# Altium project DM1092_LiPo_R0M0E0.PrjPcb (part 6 of 6)
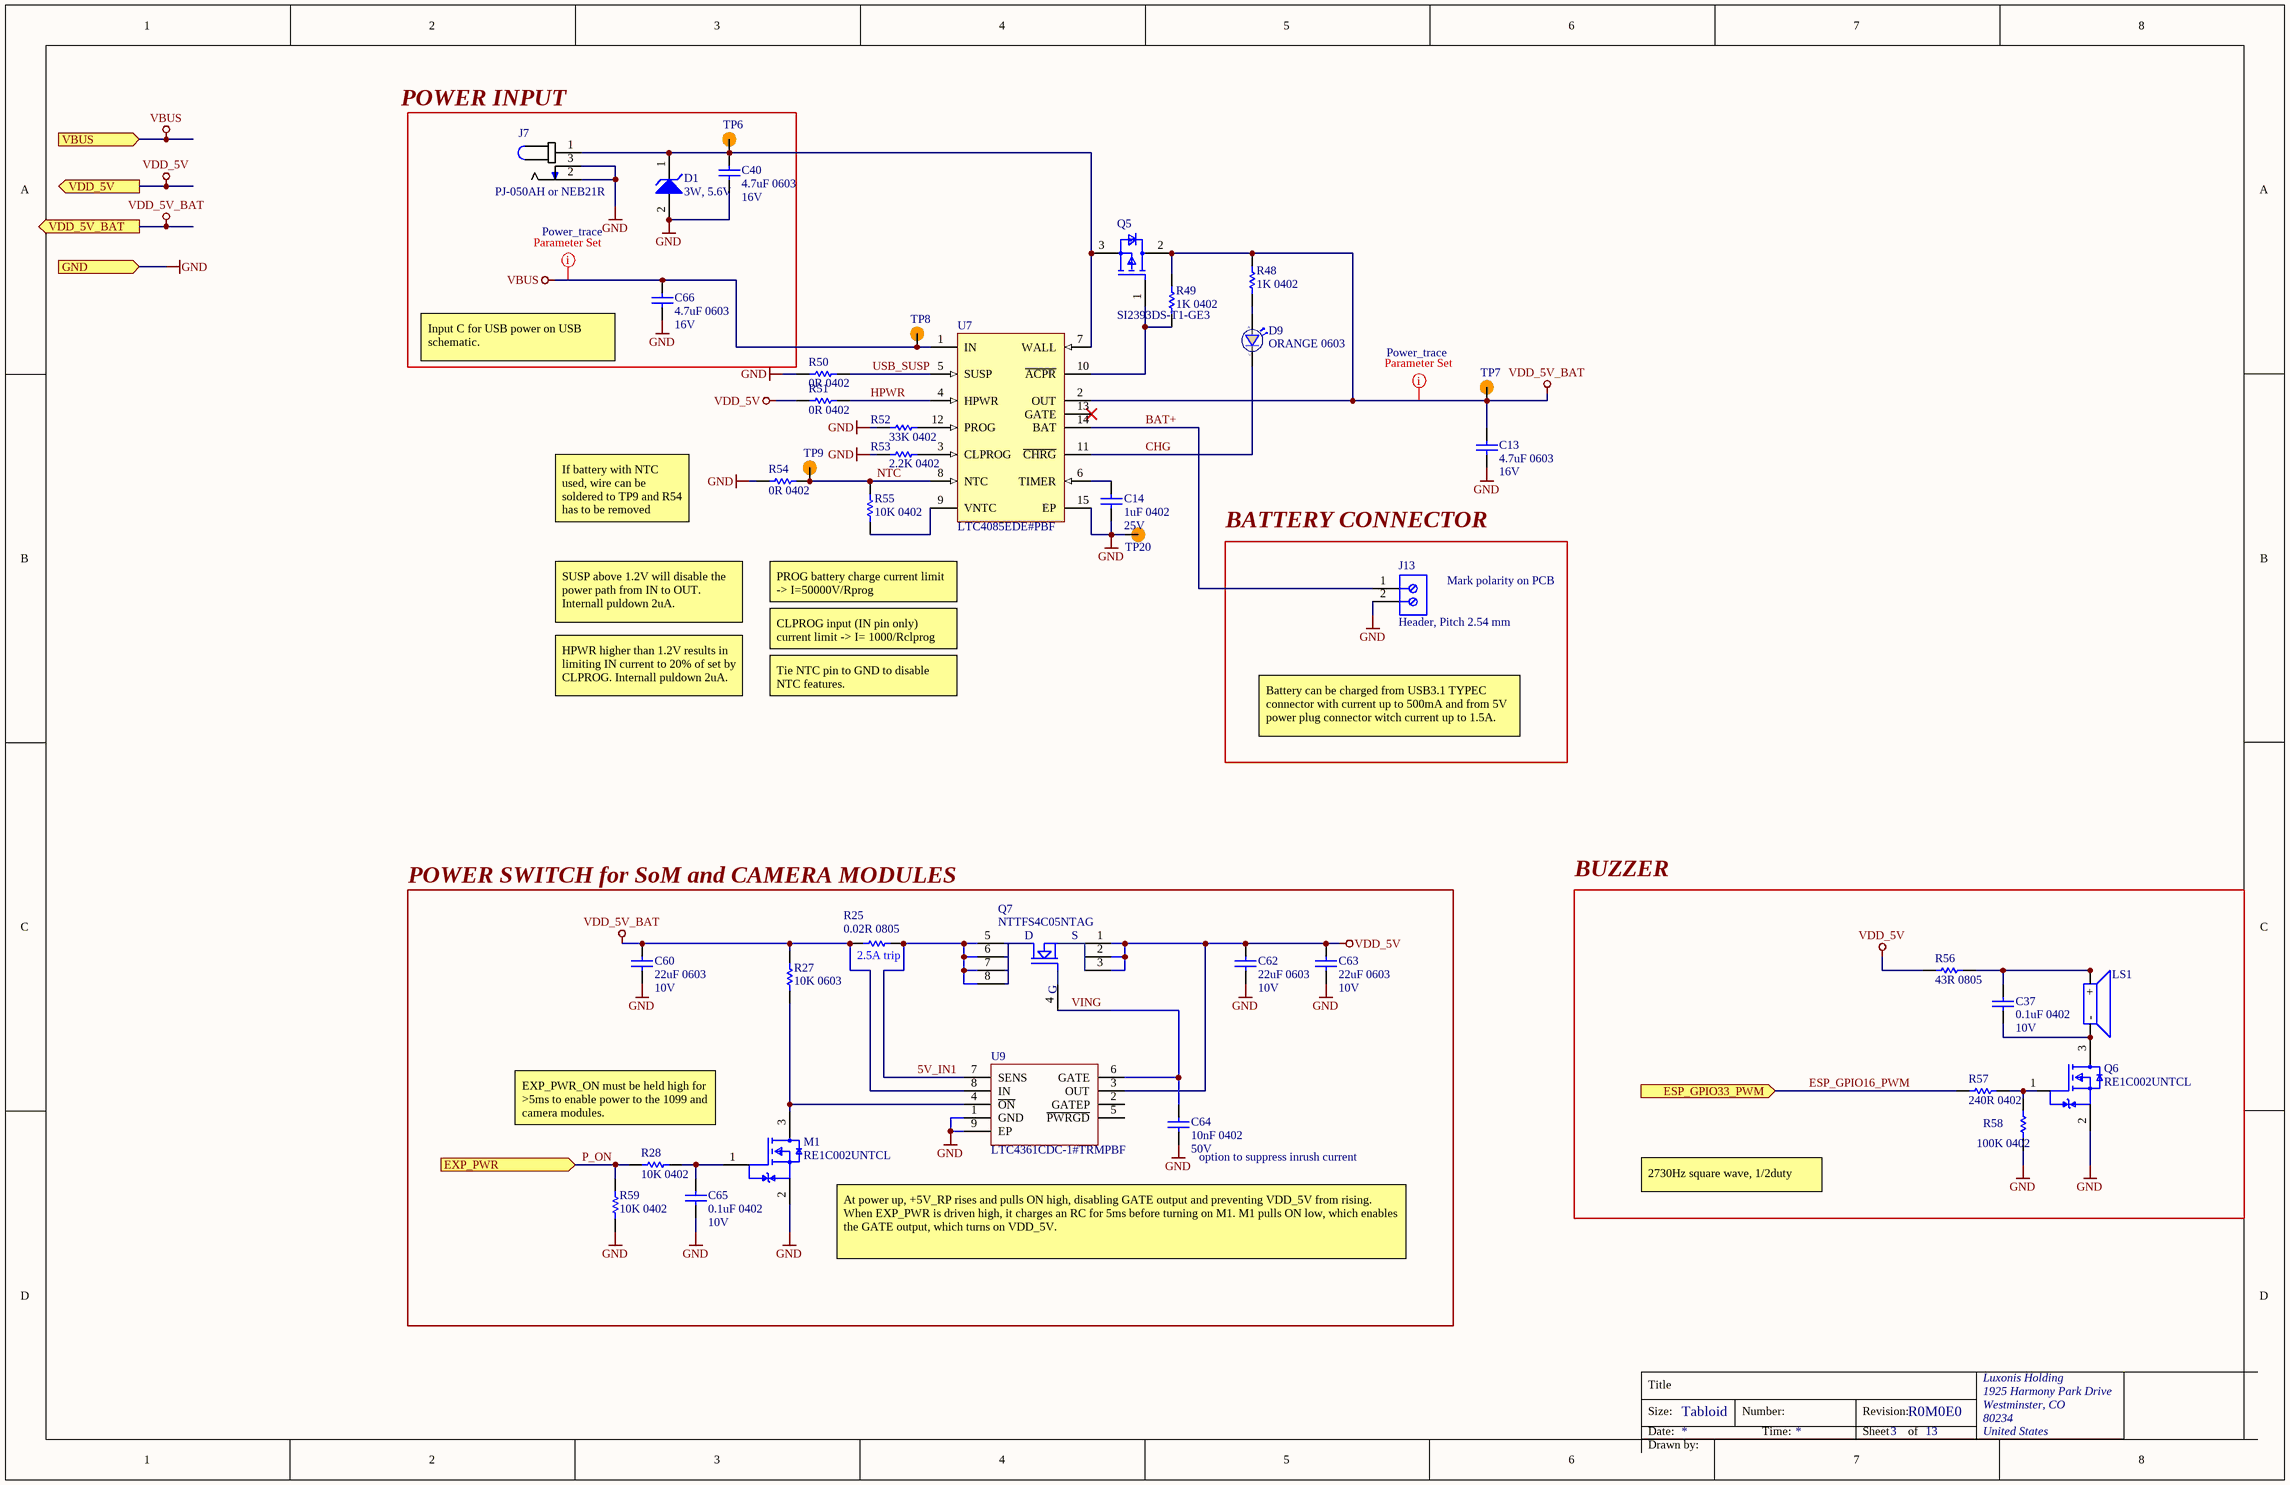
[diagram p12: DM1092_Battery&Alarm.SchDoc]

## Sheet DM1092_Battery&Alarm.SchDoc: =project_title (continued)

### Library data of the parts (continued)
R58 = RC0402FR-07100KL: RES SMD 100K OHM 1% 1/16W 0402; Manufacturer 1: Yageo; Resistance: 100kR; Temperature Coefficient: 100ppm/°C; Power Rating: 63mW; Voltage Rating: 50V; Supplier 1: Digi-Key; Supplier Part Number 1: 311-100KLRCT-ND; RoHS: Yes; Stock 1: 50867324; Pricing 1: 1=0.10000, 10=0.01500, 100=0.00600, 1000=0.00270, 2500=0.00235, 5000=0.00194 (USD); Case/Package: 0402; Case Code (Metric): 1005; Case Code (Imperial): 0402; Min Operating Temperature: -55°C; Max Operating Temperature: 155°C; Tolerance: 1%; Packaging: Tape and Reel; Termination: SMD/SMT; Length: 0.039inch; Width: 0.02inch; Height: 0.016inch; Depth: 0.5mm; REACH SVHC: No SVHC; Military Standard: Not; Lead Free: Lead Free; ComponentLink1URL: https://datasheet.ciiva.com/11819/0900766b80c66297-11819452.pdf?src-supplier=RSComponents; ComponentLink1Description: https://datasheet.ciiva.com/11819/0900766b80c66297-11819452.pdf?src-supplier=RSComponents; ComponentLink2URL: https://datasheet.ciiva.com/2453/pyu-r-int-thick-7-2453361.pdf?src-supplier=Digi-Key; ComponentLink2Description: https://datasheet.ciiva.com/2453/pyu-r-int-thick-7-2453361.pdf?src-supplier=Digi-Key; ComponentLink3URL: https://datasheet.ciiva.com/2453/pyu-r-int-thick-7-2453362.pdf?src-supplier=Digi-Key; ComponentLink3Description: https://datasheet.ciiva.com/2453/pyu-r-int-thick-7-2453362.pdf?src-supplier=Digi-Key; ComponentLink4URL: https://datasheet.ciiva.com/2453/pyu-r-int-thick-7-2453363.pdf?src-supplier=Digi-Key; ComponentLink4Description: https://datasheet.ciiva.com/2453/pyu-r-int-thick-7-2453363.pdf?src-supplier=Digi-Key; ComponentLink5URL: https://datasheet.ciiva.com/22747/1018594-22747509.pdf?src-supplier=Element14; ComponentLink5Description: https://datasheet.ciiva.com/22747/1018594-22747509.pdf?src-supplier=Element14; ComponentLink6URL: https://datasheet.ciiva.com/15189/getdatasheetpartid-323696-15189334.pdf?src-supplier=Verical; ComponentLink6Description: https://datasheet.ciiva.com/15189/getdatasheetpartid-323696-15189334.pdf?src-supplier=Verical; ComponentLink7URL: https://datasheet.ciiva.com/12667/pyu-rc0402-51-rohs-l-6-r-12667930.pdf?src-supplier=Mouser; ComponentLink7Description: https://datasheet.ciiva.com/12667/pyu-rc0402-51-rohs-l-6-r-12667930.pdf?src-supplier=Mouser; Manufacturer Part Number 1: RC0402FR-07100KL; Composition: Thick Film; Supplier 2: Newark; Supplier 3: Mouser; Supplier Part Number 2: 67R9887; Supplier Part Number 3: 603-RC0402FR-07100KL; Package Quantity: 1; Number of Terminations: 2; Max Power Dissipation: 63mW; Features: Moisture Resistant; Working Voltage: 50V
TP6-TP9 TP20 = TEST_POINT
U7 = LTC4085EDE#PBF: USB Power Manager with Ideal Diode Controller and Li-Ion Charger with 4.2 V Float Voltage, 29% Vvntc, Undervoltage Current Limit, 4.35 to 5.5 V Vin, 14-pin SON (DE-14), -40 to 85 degC, Pb-Free; Manufacturer: Linear Technology; Manufacturer 1: Analog Devices / Linear Technology; Vin Min(V): 4.35; Number of Cells: 1; Vin Max(V): 5.5; PartNumber: LTC4085EDE#PBF; DatasheetVersion: Rev. D; Code_JEDEC: MO-229; PackageVersion: Rev. B, 06/2010; ComponentLink2Description: Datasheet; ComponentLink2URL: http://cds.linear.com/docs/en/datasheet/4085fd.pdf; Number of Outputs: 1; PackageReference: DE-14; ComponentLink3URL: http://www.linear.com/docs/en/packaging/DFN_14_05-08-1708.pdf; RoHS: TRUE; ComponentLink3Description: Package Specification; Mounting Technology: Surface Mount; PackageDescription: 14-Pin Plastic DFN, Body 4 x 3 mm, Pitch 0.5 mm; ComponentLink1URL: http://www.linear.com/; ComponentLink1Description: Manufacturer URL; Manufacturer Part Number 1: LTC4085EDE#PBF; Supplier 1: Digi-Key; Supplier Part Number 1: LTC4085EDE#PBF-ND
U9 = LTC4361CDC-1#TRMPBF: IC OVERVOLTAGE/CUR PROT 8-DFN Handheld/Mobile Devices PMIC 8-DFN (2x2); Manufacturer 1: Analog Devices / Linear Technology; Min Supply Voltage: 2.5V; Max Supply Voltage: 5.5V; Supplier 1: Digi-Key; Manufacturer Part Number 1: LTC4361CDC-1#TRMPBF; Stock 1: 4205; Pricing 1: 1=3.62000, 25=2.40680, 100=1.99000, 250=1.89048 (USD); RoHS: Yes; Case/Package: DFN; Number of Pins: 8; Min Operating Temperature: 0°C; Max Operating Temperature: 70°C; Package Quantity: 1; Packaging: Tape and Reel; Length: 2mm; REACH SVHC: No SVHC; ComponentLink1URL: https://datasheet.ciiva.com/1569/1441932-1569140.pdf?src-supplier=Farnell; ComponentLink1Description: https://datasheet.ciiva.com/1569/1441932-1569140.pdf?src-supplier=Farnell; ComponentLink2URL: https://datasheet.ciiva.com/1569/1441932-1569141.pdf?src-supplier=Farnell; ComponentLink2Description: https://datasheet.ciiva.com/1569/1441932-1569141.pdf?src-supplier=Farnell; ComponentLink3URL: https://datasheet.ciiva.com/1941/29266-1941719.pdf?src-supplier=Digi-Key; ComponentLink3Description: https://datasheet.ciiva.com/1941/29266-1941719.pdf?src-supplier=Digi-Key; ComponentLink4URL: https://datasheet.ciiva.com/1511/1692593-1511384.pdf?src-supplier=Element14; ComponentLink4Description: https://datasheet.ciiva.com/1511/1692593-1511384.pdf?src-supplier=Element14; ComponentLink5URL: https://datasheet.ciiva.com/1941/29266-1941720.pdf?src-supplier=Digi-Key; ComponentLink5Description: https://datasheet.ciiva.com/1941/29266-1941720.pdf?src-supplier=Digi-Key; ComponentLink6URL: https://datasheet.ciiva.com/1941/29266-1941721.pdf?src-supplier=Digi-Key; ComponentLink6Description: https://datasheet.ciiva.com/1941/29266-1941721.pdf?src-supplier=Digi-Key; Supplier Part Number 1: LTC4361CDC-1#TRMPBFCT-ND

## Sheet DM1092_uSD.SchDoc: =project_title
size Tabloid; CompanyName: Luxonis Holding; DrawnBy: David Malovrh; Organization: Luxonis Holding; Address1: 1925 Harmony Park Drive; Address2: Westminster, CO; Address3: 80234; Address4: United States; DocumentNumber: DXXXX; Revision: R0M0E0
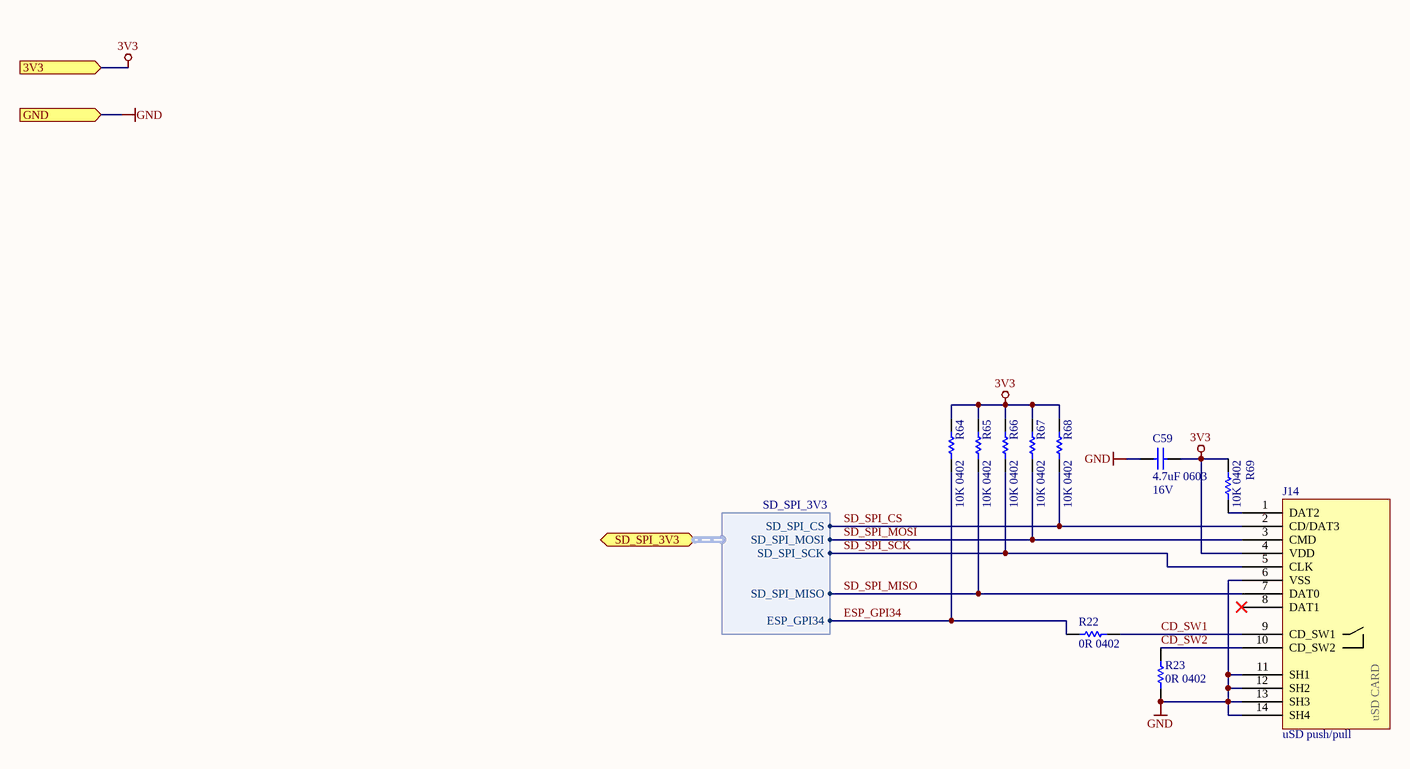
[diagram p10: DM1092_uSD.SchDoc]

### Parts
C59  4.7uF 0603  Voltage Rating: 16V  [CAPC0603(1608)100_N]
J14  uSD push/pull  [104031-0811]
R22  0R 0402  [RESC0402(1005)_N]
R23  0R 0402  [RESC0402(1005)_N]
R64  10K 0402  [RESC0402(1005)_N]
R65  10K 0402  [RESC0402(1005)_N]
R66  10K 0402  [RESC0402(1005)_N]
R67  10K 0402  [RESC0402(1005)_N]
R68  10K 0402  [RESC0402(1005)_N]
R69  10K 0402  [RESC0402(1005)_N]

### Ports
3V3 (in), GND (in), SD_SPI_3V3 (bidir, harness SD_SPI_3V3)

### Harnesses
SD_SPI_3V3: SD_SPI_MISO, SD_SPI_MOSI, SD_SPI_SCK, SD_SPI_CS, ESP_GPI34

### Nets
3V3: C59.2 J14.4(VDD) R64.2 R65.2 R66.2 R67.2 R68.2 R69.2 ; port 3V3
GND: C59.1 J14.6(VSS) J14.11(SH1) J14.12(SH2) J14.13(SH3) J14.14(SH4) R23.1 ; port GND
CD_SW1: J14.9(CD_SW1) R22.1
CD_SW2: J14.10(CD_SW2) R23.2
ESP_GPI34: R22.2 R64.1 ; port SD_SPI_3V3.ESP_GPI34
SD_SPI_CS: J14.2(CD/DAT3) R68.1 ; port SD_SPI_3V3.SD_SPI_CS
SD_SPI_MISO: J14.7(DAT0) R65.1 ; port SD_SPI_3V3.SD_SPI_MISO
SD_SPI_MOSI: J14.3(CMD) R67.1 ; port SD_SPI_3V3.SD_SPI_MOSI
SD_SPI_SCK: J14.5(CLK) R66.1 ; port SD_SPI_3V3.SD_SPI_SCK
NetJ14_1: J14.1(DAT2) R69.1

Not connected (* = marked no-connect by the designer): J14 8(DAT1)*

### Notes on the sheet
- Title
- Size:
- Date:
- Tabloid
- Number:
- Time:
- Revision:
- Sheet
- of
- Drawn by:
- (in symbol 104031-0811) uSD CARD

### Library data of the parts
C59 = GRM188R61C475KAAJD: CAP CER 4.7UF 16V X5R 0603 10%; Manufacturer 1: Murata; Material: Ceramic; Manufacturer Part Number 1: GRM188R61C475KAAJD; Supplier 1: Digi-Key; Stock 1: 455058; Pricing 1: 1=0.35000, 10=0.24600, 100=0.14730, 500=0.11050, 1000=0.09331 (USD); RoHS: Yes; Mount: Surface Mount; Case/Package: 0603; Weight: 0.000222oz; Case Code (Metric): 1608; Case Code (Imperial): 0603; Min Operating Temperature: -55°C; Max Operating Temperature: 85°C; Capacitance: 4.7uF; Tolerance: 10%; Packaging: Tape and Reel; Dielectric: X5R; Termination: SMD/SMT; Voltage Rating (DC): 16V; Package Quantity: 4000; Length: 1.6mm; Height: 0.8mm; Width: 0.8mm; Thickness: 0.037inch; Depth: 0.8mm; REACH SVHC: No SVHC; Lead Free: Lead Free; ComponentLink1URL: https://datasheet.ciiva.com/14813/595grm188r61c475kaaj23-14813668.pdf?src-supplier=Arrow; ComponentLink1Description: https://datasheet.ciiva.com/14813/595grm188r61c475kaaj23-14813668.pdf?src-supplier=Arrow; Supplier 2: Digi-Key; Manufacturer 2: Murata; Manufacturer Part Number 2: GRM188R61C475KAAJD; Stock 2: 455058; Pricing 2: 1=0.35000, 10=0.24600, 100=0.14730, 500=0.11050, 1000=0.09331 (USD); Supplier 3: Digi-Key; Manufacturer 3: Murata; Manufacturer Part Number 3: GRM188R61C475KAAJD; Stock 3: 452000; Pricing 3: 4000=0.07259, 8000=0.06832, 12000=0.06619, 28000=0.06405 (USD); Supplier Part Number 1: 490-10481-1-ND; Supplier Part Number 2: 490-10481-6-ND; Supplier Part Number 3: 490-10481-2-ND
J14 = 104031-0811: CONN MICRO SD CARD PUSH-PULL R/A; Manufacturer 1: Molex; Manufacturer Part Number 1: 104031-0811; Supplier 1: Digi-Key; Stock 1: 19400; Pricing 1: 1=2.02000, 10=1.82900, 25=1.71680, 50=1.64220, 100=1.56760, 250=1.41828, 500=1.30630, 1000=1.11969 (USD); RoHS: No; Supplier 2: Newark; Supplier 3: Mouser; Supplier Part Number 1: WM6357CT-ND; Supplier Part Number 2: 99R5410; Supplier Part Number 3: 538-104031-0811
R22 R23 = CRCW04020000Z0ED: RES SMD 0 OHM JUMPER 1/16W 0402; Manufacturer 1: Vishay; Resistance: 0mR; Power Rating: 63mW; Voltage Rating: 50V; Temperature Coefficient: 100ppm/°C; Tolerance: 5%; Manufacturer Part Number 1: CRCW04020000Z0ED; Supplier 1: Digi-Key; Stock 1: 855968; Pricing 1: 1=0.10000, 10=0.03400, 25=0.02440, 50=0.01860, 100=0.01380, 250=0.01048, 500=0.00840, 1000=0.00618, 5000=0.00443 (USD); RoHS: Yes; Mount: Surface Mount; Case/Package: 0402; Weight: 2.3E-05oz; Case Code (Imperial): 0402; Case Code (Metric): 1005; Contact Plating: Tin; Min Operating Temperature: -55°C; Max Operating Temperature: 155°C; Packaging: Tape and Reel; Composition: Thick Film; Voltage Rating (DC): 50V; Package Quantity: 1; Termination: SMD/SMT; Number of Terminations: 2; Military Standard: Not; Max Power Dissipation: 63mW; Features: Automotive AEC-Q200; Length: 1mm; Height: 0.35mm; Width: 0.5mm; Depth: 0.5mm; Radiation Hardening: No; REACH SVHC: Unknown; Lead Free: Lead Free; ComponentLink1URL: https://datasheet.ciiva.com/3255/dcrcwe3-3255944.pdf?src-supplier=Avnet; ComponentLink1Description: https://datasheet.ciiva.com/3255/dcrcwe3-3255944.pdf?src-supplier=Avnet; ComponentLink2URL: https://datasheet.ciiva.com/3255/dcrcwe3-3255945.pdf?src-supplier=Avnet; ComponentLink2Description: https://datasheet.ciiva.com/3255/dcrcwe3-3255945.pdf?src-supplier=Avnet; ComponentLink3URL: https://datasheet.ciiva.com/16881/dcrcwe3-16881413.pdf?src-supplier=Avnet+Europe; ComponentLink3Description: https://datasheet.ciiva.com/16881/dcrcwe3-16881413.pdf?src-supplier=Avnet+Europe; ComponentLink4URL: https://datasheet.ciiva.com/2461/dcrcwe3-2461962.pdf?src-supplier=Digi-Key; ComponentLink4Description: https://datasheet.ciiva.com/2461/dcrcwe3-2461962.pdf?src-supplier=Digi-Key; ComponentLink5URL: https://datasheet.ciiva.com/7841/1720486-7841802.pdf?src-supplier=Element14; ComponentLink5Description: https://datasheet.ciiva.com/7841/1720486-7841802.pdf?src-supplier=Element14; ComponentLink6URL: https://datasheet.ciiva.com/2461/dcrcwe3-2461963.pdf?src-supplier=Digi-Key; ComponentLink6Description: https://datasheet.ciiva.com/2461/dcrcwe3-2461963.pdf?src-supplier=Digi-Key; ComponentLink7URL: https://datasheet.ciiva.com/2461/dcrcwe3-2461964.pdf?src-supplier=Digi-Key; ComponentLink7Description: https://datasheet.ciiva.com/2461/dcrcwe3-2461964.pdf?src-supplier=Digi-Key; ComponentLink8URL: https://datasheet.ciiva.com/7841/1697337-7841468.pdf?src-supplier=Element14; ComponentLink8Description: https://datasheet.ciiva.com/7841/1697337-7841468.pdf?src-supplier=Element14; ComponentLink9URL: https://datasheet.ciiva.com/16761/70200976-16761309.pdf?src-supplier=Allied+Electronics; ComponentLink9Description: https://datasheet.ciiva.com/16761/70200976-16761309.pdf?src-supplier=Allied+Electronics; ComponentLink10URL: https://datasheet.ciiva.com/26311/fld-crcw-e3-data-en-26311550.pdf?src-supplier=Distrelec; ComponentLink10Description: https://datasheet.ciiva.com/26311/fld-crcw-e3-data-en-26311550.pdf?src-supplier=Distrelec; Supplier Part Number 1: 541-0.0JCT-ND
R64-R69 = RC0402FR-1310KL: RES SMD 10K OHM 1% 0402 1/16W Chip Resistor, 0402 [1005 Metric], 10 kohm, RC Series, 50 V, Thick Film, 62.5 mW; Manufacturer 1: Yageo; Resistance: 10kR; Temperature Coefficient: 100ppm/°C; Power Rating: 62.5mW; Voltage Rating: 50V; ComponentLink1URL: https://datasheet.ciiva.com/16940/pyu-rc0402-51-rohs-l-6-16940293.pdf?src-supplier=Avnet+Europe; ComponentLink1Description: https://datasheet.ciiva.com/16940/pyu-rc0402-51-rohs-l-6-16940293.pdf?src-supplier=Avnet+Europe; ComponentLink2URL: https://datasheet.ciiva.com/28386/pyu-rc0402-51-rohs-l-6-28386855.pdf?src-supplier=Avnet+Europe; ComponentLink2Description: https://datasheet.ciiva.com/28386/pyu-rc0402-51-rohs-l-6-28386855.pdf?src-supplier=Avnet+Europe; ComponentLink3URL: https://datasheet.ciiva.com/16740/pyu-rc0402-51-rohs-l-6-r-16740602.pdf?src-supplier=Future+Electronics; ComponentLink3Description: https://datasheet.ciiva.com/16740/pyu-rc0402-51-rohs-l-6-r-16740602.pdf?src-supplier=Future+Electronics; ComponentLink4URL: https://datasheet.ciiva.com/8891/pyu-rc0402-51-rohs-l-6-8891339.pdf?src-supplier=Avnet; ComponentLink4Description: https://datasheet.ciiva.com/8891/pyu-rc0402-51-rohs-l-6-8891339.pdf?src-supplier=Avnet; ComponentLink5URL: https://datasheet.ciiva.com/5557/pyu-rc0402-51-rohs-l-6-r-5557997.pdf?src-supplier=Mouser; ComponentLink5Description: https://datasheet.ciiva.com/5557/pyu-rc0402-51-rohs-l-6-r-5557997.pdf?src-supplier=Mouser; ComponentLink6URL: https://datasheet.ciiva.com/7983/1018594-7983533.pdf?src-supplier=Element14; ComponentLink6Description: https://datasheet.ciiva.com/7983/1018594-7983533.pdf?src-supplier=Element14; Supplier 1: Newark; Manufacturer Part Number 1: RC0402FR-1310KL; Stock 1: 62239; Pricing 1: 1=0.10000, 25=0.01200, 100=0.00400, 250=0.00400, 500=0.00300, 1000=0.00300 (USD); RoHS: Yes; Case/Package: 0402; Number of Pins: 2; Contact Plating: Tin,Matte,Lead; Case Code (Imperial): 0402; Case Code (Metric): 1005; Min Operating Temperature: -55°C; Max Operating Temperature: 155°C; Tolerance: 1%; Composition: Thick Film; Packaging: Tape and Reel; Termination: SMD/SMT; Military Standard: Not; Voltage Rating (DC): 50V; Working Voltage: 50V; Number of Terminations: 2; Length: 1mm; Depth: 0.5mm; Radiation Hardening: No; REACH SVHC: No SVHC; Lead Free: Lead Free; Supplier Part Number 1: 67R9960; Supplier 2: Future Electronics; Supplier 3: Mouser; Supplier 4: Element14; Supplier Part Number 2: RC0402FR-1310KL-CUTT; Supplier Part Number 3: 603-RC0402FR-1310KL; Supplier Part Number 4: 1799235

## Nets that join several sheets
1V2: DM1092_Power_Supply (C39.2 TP10.1 U8.5), DM1092_LEFT_OV9282 (FB6.1)
1V8: DM1092_Power_Supply (C18.2 TP11.1 U2.5), DM1092_LEFT_OV9282 (FB5.1), DM1092_IMU (10 pins), DM1092_LEVEL_SHIFT (6 pins)
2V8: DM1092_Power_Supply (C20.2 TP12.1 U3.5), DM1092_LEFT_OV9282 (FB4.1)
3V3: DM1092_Power_Supply (C16.1 L2.2 R5.2), DM1092_USB (C35.2 R13.2 U5.6), DM1092_ESP32 (9 pins), DM1092_IMU (C42.2 C44.2 U12.3), DM1092_QWIIC (J11.3 J12.3), DM1092_LEVEL_SHIFT (C49.2 C53.2 U13.19 U14.19), DM1092_uSD (8 pins)
GND: DM1092_TopLevel (MP5.1 MP6.1 MP7.1 MP8.1), DM1092_Power_Supply (24 pins), DM1092_LEFT_OV9282 (16 pins), DM1092_USB (28 pins), DM1092_ESP32 (26 pins), DM1092_IMU (10 pins), DM1092_QWIIC (6 pins), DM1092_LEVEL_SHIFT (10 pins), DM1092_Battery&Alarm (25 pins), DM1092_uSD (7 pins)
VBUS: DM1092_USB (10 pins), DM1092_Battery&Alarm (C66.2 TP8.1 U7.1)
VDD_5V: DM1092_Power_Supply (13 pins), DM1092_USB (C36.2 R20.2 R21.2 U6.12), DM1092_Battery&Alarm (8 pins)
VDD_5V_BAT: DM1092_Power_Supply (C15.2 U1.3 U1.5), DM1092_Battery&Alarm (10 pins)
ENV_SCL_1V8: DM1092_IMU (R37.2 U12.15), DM1092_LEVEL_SHIFT (U14.5)
ENV_SCL_3V3: DM1092_QWIIC (J12.1), DM1092_LEVEL_SHIFT (U14.16)
ENV_SDA_1V8: DM1092_IMU (R38.2 U12.16), DM1092_LEVEL_SHIFT (U14.6)
ENV_SDA_3V3: DM1092_QWIIC (J12.2), DM1092_LEVEL_SHIFT (U14.15)
ESP_GPI34: DM1092_ESP32 (J5.4 U11.6), DM1092_uSD (R22.2 R64.1)
ESP_GPIO16_PWM: DM1092_ESP32 (U11.9), DM1092_Battery&Alarm (R57.1)
ESP_GPIO27: DM1092_ESP32 (TP47.1 U11.12), DM1092_LEVEL_SHIFT (U13.13)
EXP_PWR: DM1092_ESP32 (U10.2), DM1092_Battery&Alarm (R28.2 R59.2)
GPIO8/SPI0_CS_1: DM1092_IMU (U12.18), DM1092_LEVEL_SHIFT (U13.8)
I2C3_SCL_3V3: DM1092_ESP32 (R62.1 TP43.1 U10.6 U11.10), DM1092_QWIIC (J11.1), DM1092_LEVEL_SHIFT (U14.14)
I2C3_SDA_3V3: DM1092_ESP32 (R63.1 TP46.1 U10.7 U11.11), DM1092_QWIIC (J11.2), DM1092_LEVEL_SHIFT (U14.13)
MX_INT_3V3: DM1092_ESP32 (TP36.1 U11.8), DM1092_LEVEL_SHIFT (U14.17)
MX_RST_3V3: DM1092_ESP32 (TP45.1 U10.1), DM1092_LEVEL_SHIFT (U14.20)
SD_SPI_CS: DM1092_ESP32 (U11.27), DM1092_uSD (J14.2 R68.1)
SD_SPI_MISO: DM1092_ESP32 (R60.2 TP33.1 U11.36), DM1092_uSD (J14.7 R65.1)
SD_SPI_MOSI: DM1092_ESP32 (R61.2 TP40.1 U11.33), DM1092_uSD (J14.3 R67.1)
SD_SPI_SCK: DM1092_ESP32 (U11.28), DM1092_uSD (J14.5 R66.1)
SPI0_SCK: DM1092_IMU (U12.19), DM1092_LEVEL_SHIFT (U13.6)
SPI0_SIO0: DM1092_IMU (U12.17), DM1092_LEVEL_SHIFT (U13.1)
SPI0_SIO1: DM1092_IMU (U12.20), DM1092_LEVEL_SHIFT (U13.3)
VSPI_CS0: DM1092_ESP32 (TP44.1 U11.29), DM1092_LEVEL_SHIFT (U13.14)
VSPI_HOLDn_SIO3: DM1092_ESP32 (R61.1), DM1092_LEVEL_SHIFT (U13.16)
VSPI_SCK: DM1092_ESP32 (TP42.1 U11.30), DM1092_LEVEL_SHIFT (U13.15)
VSPI_SDI_SIO1: DM1092_ESP32 (TP41.1 U11.31), DM1092_LEVEL_SHIFT (U13.18)
VSPI_SDO_SIO0: DM1092_ESP32 (TP31.1 U11.37), DM1092_LEVEL_SHIFT (U13.20)
VSPI_WPn_SIO2: DM1092_ESP32 (R60.1), DM1092_LEVEL_SHIFT (U13.17)

## Assembly variants
Production: not fitted J5 J6 MISC1 R18 R19 R22 R23 R47 R60 R61 R62 R63 R70 R71 R72